# Altium schematic sheet amplifier_stage.SchDoc
size A4; SheetNumber: 3; SheetTotal: 6
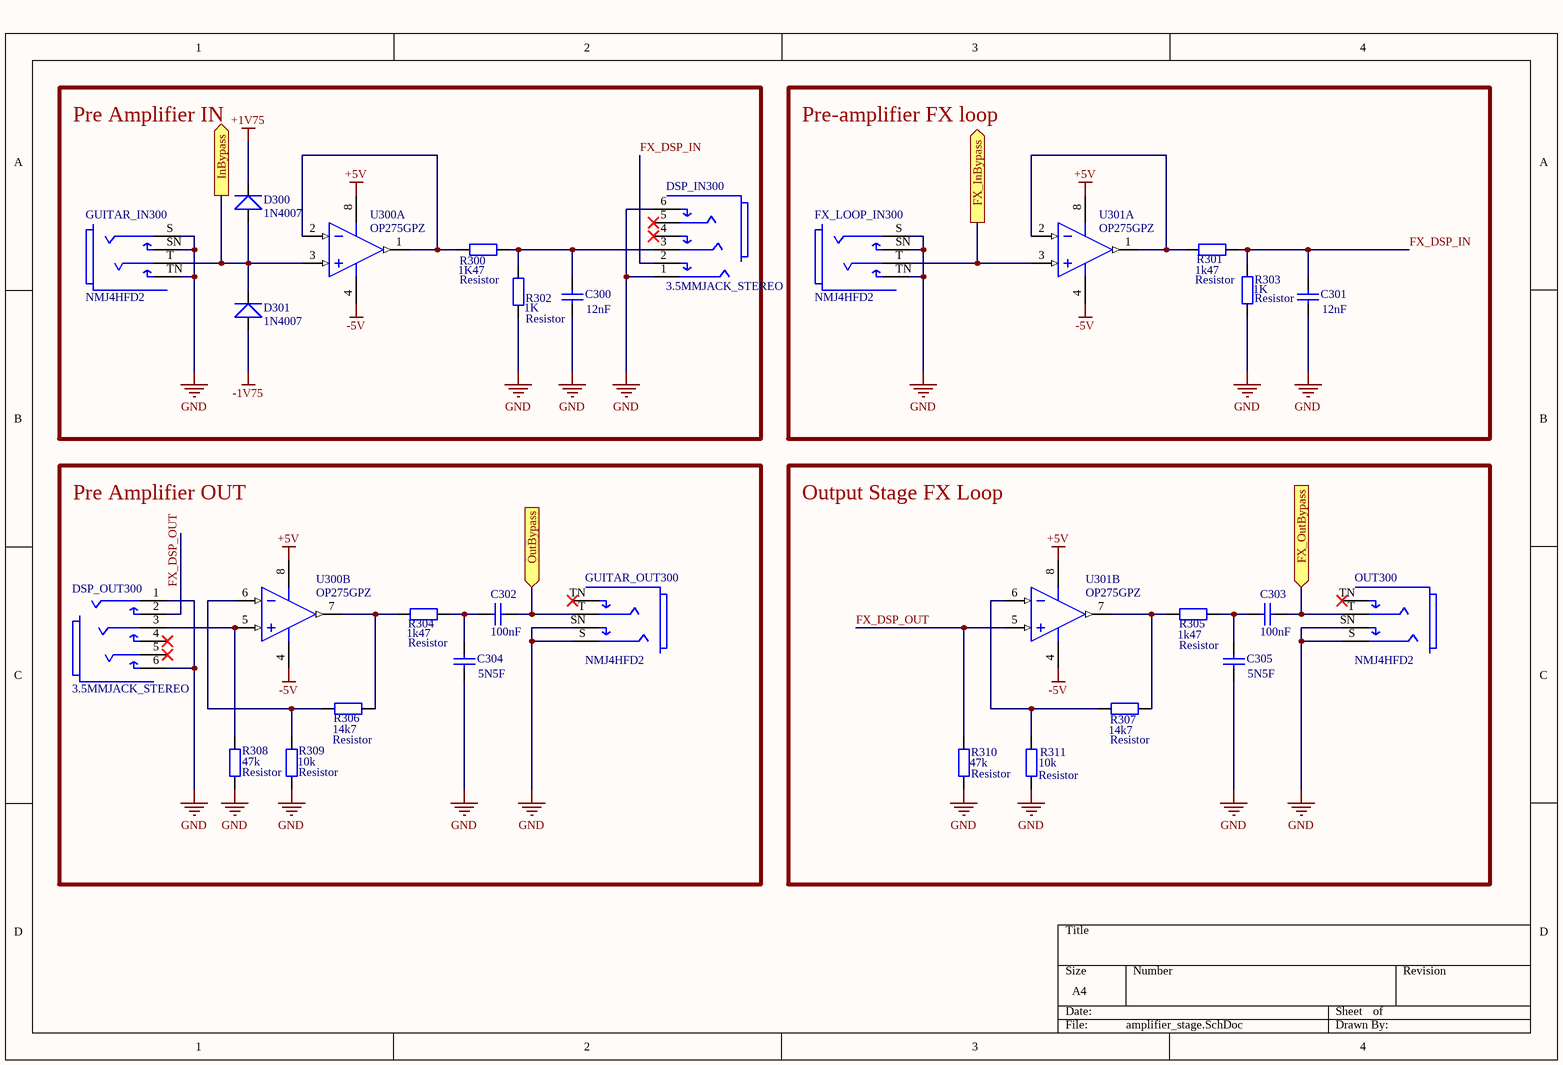
[diagram p0: amplifier_stage.SchDoc]

## Parts
C300  value 12nF  [Cap-1]  (hidden comment: Cap)
C301  value 12nF  [Cap-1]  (hidden comment: Cap)
C302  value 100nF  [Cap-1]  (hidden comment: Cap)
C303  value 100nF  [Cap-1]  (hidden comment: Cap)
C304  value 5N5F  [Cap-1]  (hidden comment: Cap)
C305  value 5N5F  [Cap-1]  (hidden comment: Cap)
D300  1N4007  [1N4007]
D301  1N4007  [1N4007]
DSP_IN300  3.5MMJACK_STEREO  [3.5MMJACK_STEREO]
DSP_OUT300  3.5MMJACK_STEREO  [3.5MMJACK_STEREO]
FX_LOOP_IN300  NMJ4HFD2  [FP-NMJ4HFD2-MFG]
GUITAR_IN300  NMJ4HFD2  [FP-NMJ4HFD2-MFG]
GUITAR_OUT300  NMJ4HFD2  [FP-NMJ4HFD2-MFG]
OUT300  NMJ4HFD2  [FP-NMJ4HFD2-MFG]
R300  Resistor  value 1K47  [RES THT 9mm]
R301  Resistor  value 1k47  [RES THT 9mm]
R302  Resistor  value 1K  [RES THT 9mm]
R303  Resistor  value 1K  [RES THT 9mm]
R304  Resistor  value 1k47  [RES THT 9mm]
R305  Resistor  value 1k47  [RES THT 9mm]
R306  Resistor  value 14k7  [RES THT 9mm]
R307  Resistor  value 14k7  [RES THT 9mm]
R308  Resistor  value 47k  [RES THT 9mm]
R309  Resistor  value 10k  [RES THT 9mm]
R310  Resistor  value 47k  [RES THT 9mm]
R311  Resistor  value 10k  [RES THT 9mm]
U300  OP275GPZ  [ADI-N-8]  (parts A,B of 2)
U301  OP275GPZ  [ADI-N-8]  (parts A,B of 2)

## Blocks framed on the sheet
Pre Amplifier IN: C300 D300 D301 DSP_IN300 GUITAR_IN300 R300 R302 U300
Pre-amplifier FX loop: C301 FX_LOOP_IN300 R301 R303 U301
Pre Amplifier OUT: C302 C304 DSP_OUT300 GUITAR_OUT300 R304 R306 R308 R309 U300
Output Stage FX Loop: C303 C305 OUT300 R305 R307 R310 R311 U301

## Ports
FX_InBypass (out), FX_OutBypass (in), InBypass (out), OutBypass (in)

## Nets
+1V75: D300.2
+5V: U300.8(+V) U301.8(+V)
-1V75: D301.1
-5V: U300.4(-V) U301.4(-V)
GND: C300.1 C301.1 C304.1 C305.1 DSP_IN300.1(S) DSP_IN300.6(TN) DSP_OUT300.1(S) DSP_OUT300.6(TN) FX_LOOP_IN300.S FX_LOOP_IN300.SN FX_LOOP_IN300.TN GUITAR_IN300.S GUITAR_IN300.SN GUITAR_IN300.TN GUITAR_OUT300.S GUITAR_OUT300.SN OUT300.S OUT300.SN R302.1 R303.1 R308.1 R309.1 R310.1 R311.1
FX_DSP_IN: C301.2(g) DSP_IN300.2(SN) R301.2 R303.2
FX_DSP_OUT: DSP_OUT300.2(SN) R310.2 U301.5(+IN_B)
FX_InBypass: FX_LOOP_IN300.T U301.3(+IN_A) ; port FX_InBypass
FX_OutBypass: C303.1 OUT300.T ; port FX_OutBypass
InBypass: D300.1 D301.2 GUITAR_IN300.T U300.3(+IN_A) ; port InBypass
OutBypass: C302.1 GUITAR_OUT300.T ; port OutBypass
NetC300_2: C300.2(g) DSP_IN300.3(S) R300.2 R302.2
NetC302_2: C302.2(g) C304.2(g) R304.2
NetC303_2: C303.2(g) C305.2(g) R305.2
NetDSP_OUT300_3: DSP_OUT300.3(S) R308.2 U300.5(+IN_B)
NetR300_1: R300.1 U300.1(OUT_A) U300.2(-IN_A)
NetR301_1: R301.1 U301.1(OUT_A) U301.2(-IN_A)
NetR304_1: R304.1 R306.2 U300.7(OUT_B)
NetR305_1: R305.1 R307.2 U301.7(OUT_B)
NetR306_1: R306.1 R309.2 U300.6(-IN_B)
NetR307_1: R307.1 R311.2 U301.6(-IN_B)

Not connected (* = marked no-connect by the designer): DSP_IN300 4(SN)* 5(T)*; DSP_OUT300 4(SN)* 5(T)*; GUITAR_OUT300 TN*; OUT300 TN*

## Library data of the parts
C300-C305 = Capacitor 1 space
FX_LOOP_IN300 GUITAR_IN300 GUITAR_OUT300 OUT300 = CMP-78736-000001-1: Conn 1/4" Mono Jack F 3 POS Solder RA Thru-Hole 3 Terminal 1 Port; Manufacturer: Neutrik; Number Of Contacts: 2; Current Rating: 0.5A; Voltage Rating: 50V; Conn Orientation: Horizontal; Is Female: yes; Temperature: -25°C to +70°C; ComponentLink2Description: Datasheet; ComponentLink2URL: https://www.neutrik.com/en/product/nmj4hfd2.pdf; Contact Material: Silver; Height: 15.89mm; Package: 0; Mouser Description: Phone Audio Connector, Socket, 2, PCB Mount, Metal Body, Silver Plated Contacts; Manufacturer Part Number: NMJ4HFD2; Automotive: No; RoHS: TRUE; Lead Free: Yes; Device Class L2: Audio / Video Connectors; Device Class L3: unset; Temperature Range Low: -25°C; Category: Conn; Footprint Url: https://www.neutrik.com/media/8576/download/st-nmj4hfd2.pdf?v=1; Temperature Range High: +70°C; Device Class L1: Connectors; Octopart: https://octopart.com/nmj4hfd2-neutrik-758952
U300 U301 = CMP-0384-00207-1: Double Channel Excellent Sonic Characteristics Operational Amplifier, 9 MHz BW, 22 V/us SR, Industrial, 8-pin DIP (N-8), Tube; Manufacturer: Analog Devices; Generic Part Number: OP275; V Span Min: 9V; Slew Rate: 22V/us; Iq/Amp: 2.5mA; Input Offset Voltage: 1mV; Small Signal Bandwidth: 9MHz; Amplifiers Per Package: 2; V Span Max: 44V; Input Bias Current: 100nA; ComponentLink3Description: Package Specification; ComponentLink3URL: http:/www.analog.com/static/imported-files/packages/PKG_PDF/PDIP(N)/N_8.pdf; Mounting Technology: Through Hole; ComponentLink1Description: Manufacturer URL; ComponentLink2URL: http://www.analog.com/static/imported-files/data_sheets/OP275.pdf; PartNumber: OP275GPZ; ComponentLink1URL: http://www.analog.com/en/index.html; PackageReference: N-8; ComponentLink2Description: Datasheet; DatasheetVersion: Rev. C; PackageDescription: 8-Pin Plastic Dual In-Line Package, Row spacing 7.62 mm, Pitch 2.54 mm; PackageVersion: 070606-A; Code_JEDEC: MS-001